# Altium project 7798-20-0228.PrjPcb (part 2 of 2)
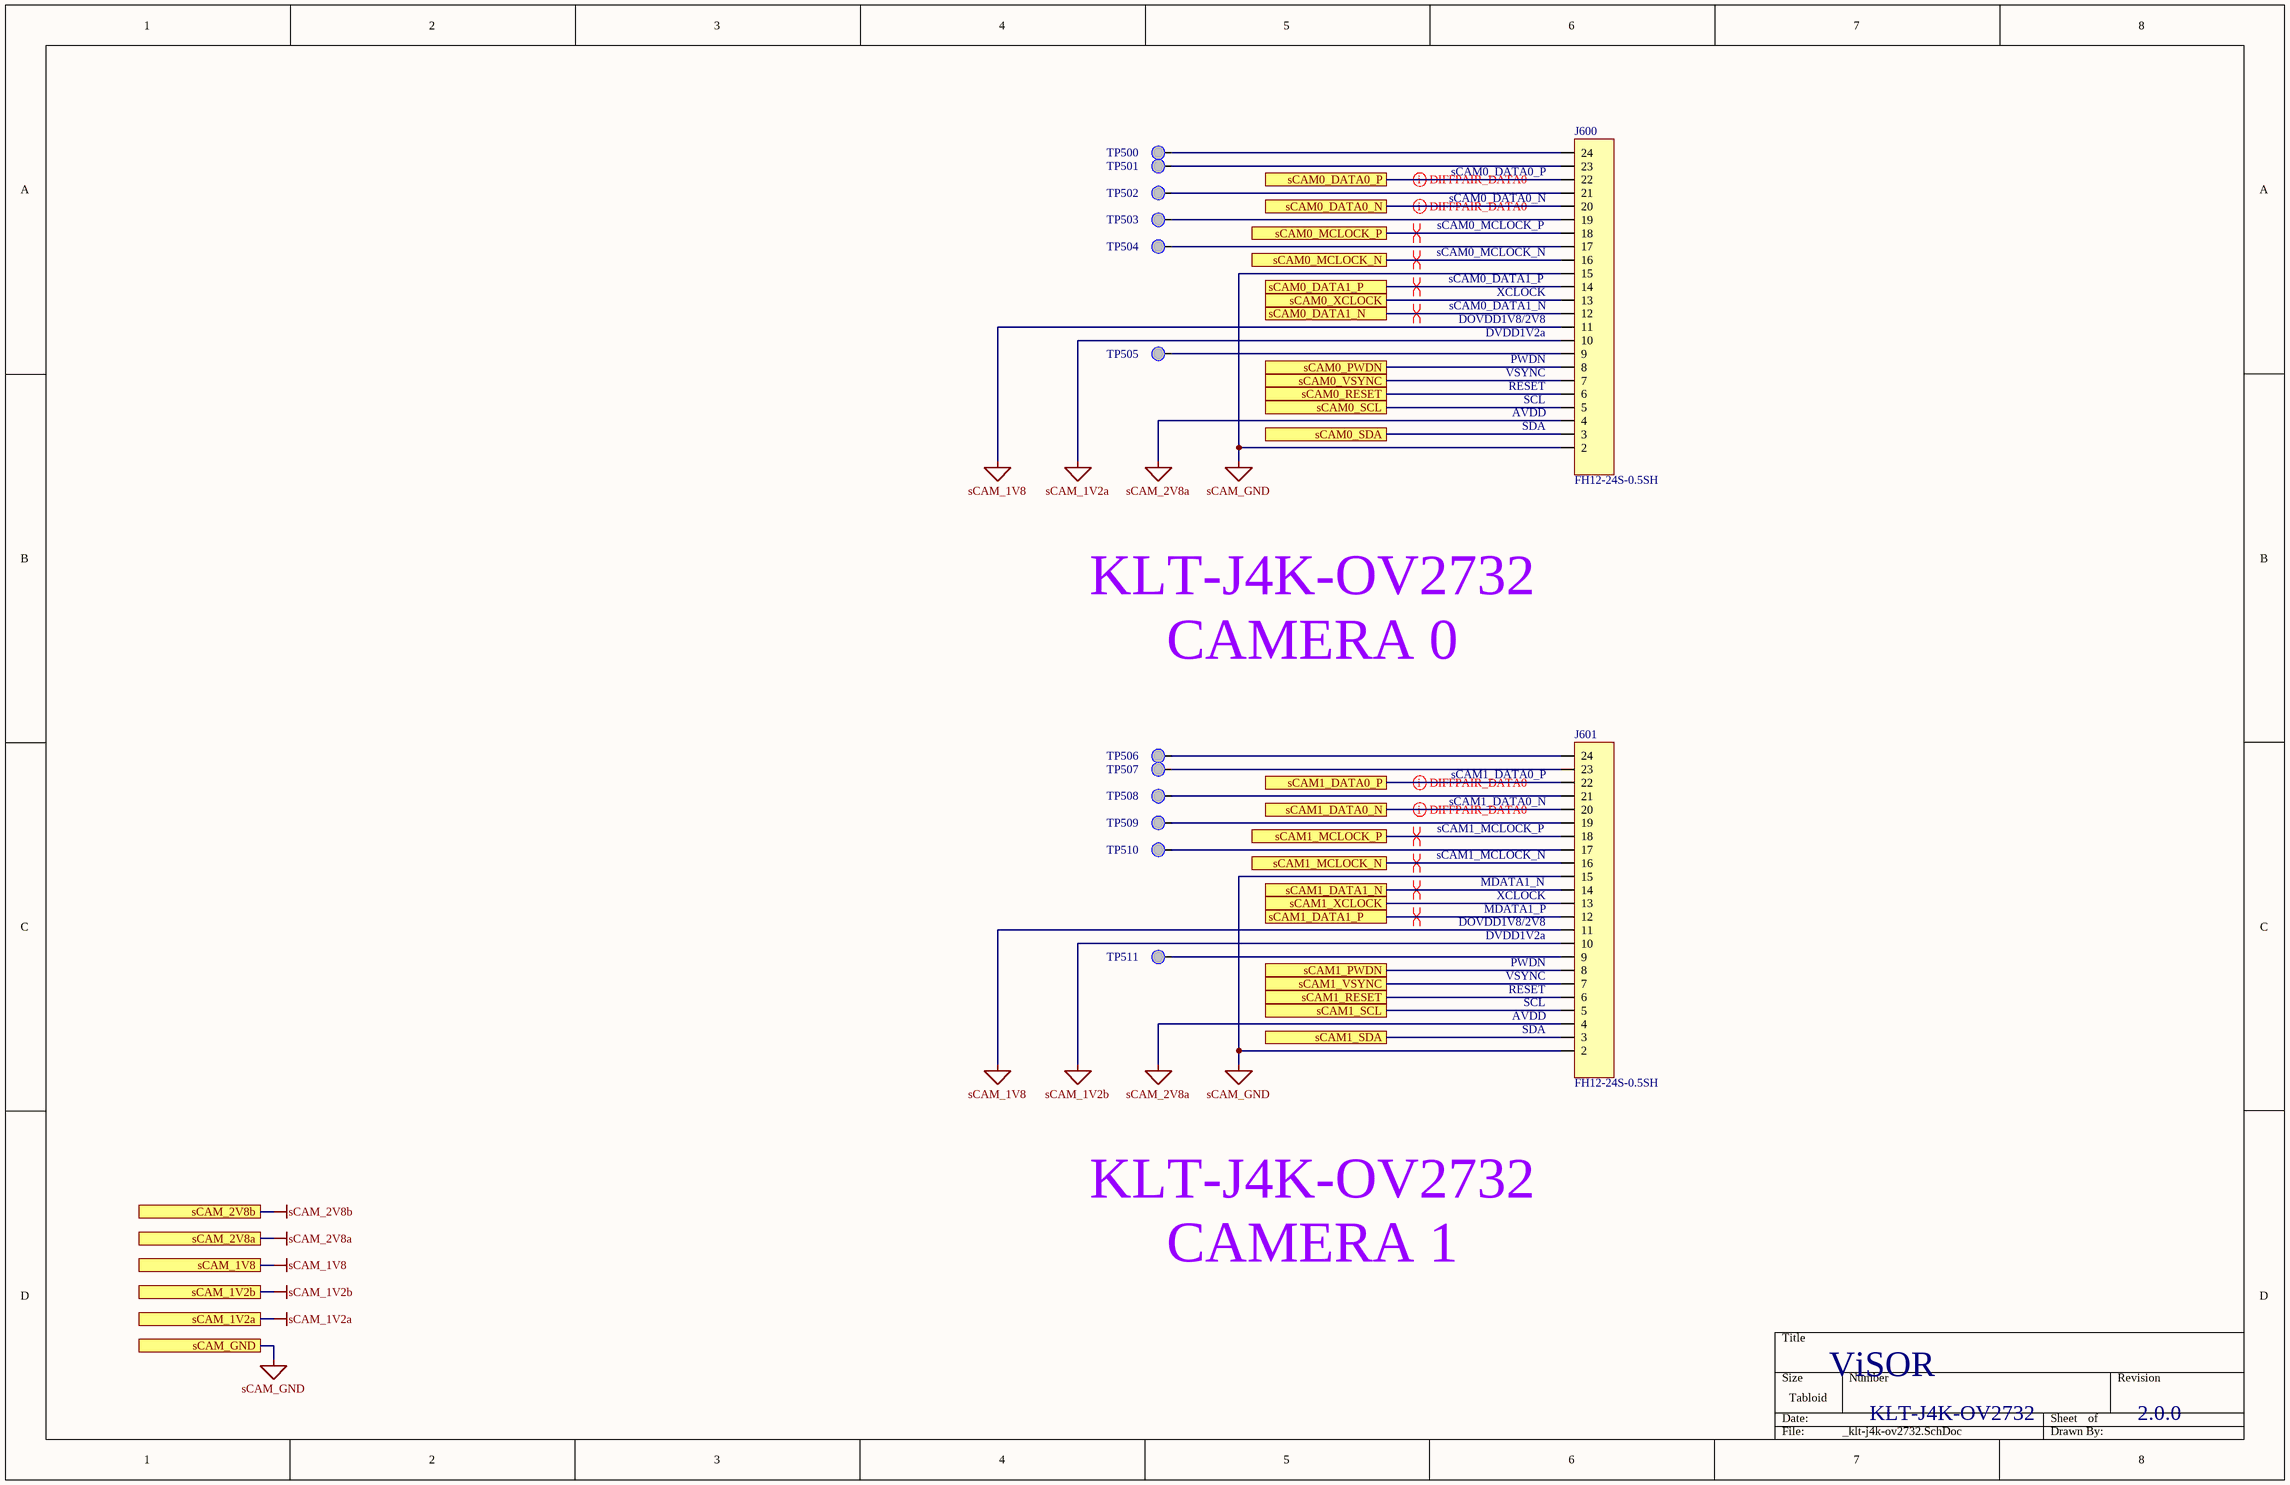
[diagram p9: _klt-j4k-ov2732.SchDoc]

## Nets that join several sheets
sGND: _dragonboard (31 pins), _power (33 pins), _io (17 pins), _accel_mag (11 pins), _gyroscope (19 pins), _li-ov5640-mipi-af (22 pins), _klt-kr7-ov7251 (24 pins), _klt-j4k-ov2732 (J600.2 J600.15 J601.2 J601.15)
sPWR_1V2a: _power (C109.2 R104.1 TP107.1 U104.1), _klt-j4k-ov2732 (J600.10)
sPWR_1V2b: _power (C111.2 R105.1 TP108.1 U105.1), _klt-j4k-ov2732 (J601.10)
sPWR_1V5a: _power (C101.2 R100.1 TP100.1 U100.1), _li-ov5640-mipi-af (C405.2 C407.1 U400.10), _klt-kr7-ov7251 (C505.2 C507.1 J500.14)
sPWR_1V5b: _power (C103.2 R101.1 TP102.1 U101.1), _li-ov5640-mipi-af (C413.2 C415.1 U401.10), _klt-kr7-ov7251 (C513.2 C515.1 J501.14)
sPWR_1V8: _dragonboard (C4.2 C6.2 J2.35 TP15.1), _io (J5.2 R11.2), _accel_mag (5 pins), _gyroscope (C351.2 R350.1 U350.18), _li-ov5640-mipi-af (6 pins), _klt-kr7-ov7251 (6 pins), _klt-j4k-ov2732 (J600.11 J601.11)
sPWR_2V8a: _power (C105.2 R102.1 TP103.1 U102.1), _li-ov5640-mipi-af (6 pins), _klt-kr7-ov7251 (6 pins), _klt-j4k-ov2732 (J600.4 J601.4)
sPWR_2V8b: _power (C107.2 R103.1 TP104.1 U103.1), _li-ov5640-mipi-af (6 pins)
sPWR_3V3: _power (5 pins), _io (5 pins), _accel_mag (C303.2 C304.2 U300.14), _gyroscope (C352.2 C353.1 U350.15 U350.17)
sPWR_5V0: _dragonboard (C3.2 C5.2 J2.37 TP14.1), _power (23 pins)
sSYS_DCIN: _dragonboard (J2.36 J2.38), _power (J3.1)
sCAM0_DATA0_N: _dragonboard (J1.10), _li-ov5640-mipi-af (U400.22), _klt-kr7-ov7251 (J500.10), _klt-j4k-ov2732 (J600.20)
sCAM0_DATA0_P: _dragonboard (J1.8), _li-ov5640-mipi-af (U400.20), _klt-kr7-ov7251 (J500.11), _klt-j4k-ov2732 (J600.22)
sCAM0_DATA1_N: _dragonboard (J1.16), _li-ov5640-mipi-af (U400.14), _klt-j4k-ov2732 (J600.12)
sCAM0_DATA1_P: _dragonboard (J1.14), _li-ov5640-mipi-af (U400.12), _klt-j4k-ov2732 (J600.14)
sCAM0_SCL: TOP (R12.2 TP11.1), _li-ov5640-mipi-af (U400.5), _klt-kr7-ov7251 (J500.3), _klt-j4k-ov2732 (J600.5)
sCAM0_SDA: TOP (R14.2 TP12.1), _li-ov5640-mipi-af (U400.3), _klt-kr7-ov7251 (J500.2), _klt-j4k-ov2732 (J600.3)
sCAM1_DATA0_N: _dragonboard (J1.44), _li-ov5640-mipi-af (U401.22), _klt-kr7-ov7251 (J501.10), _klt-j4k-ov2732 (J601.20)
sCAM1_DATA0_P: _dragonboard (J1.42), _li-ov5640-mipi-af (U401.20), _klt-kr7-ov7251 (J501.11), _klt-j4k-ov2732 (J601.22)
sCAM1_DATA1_N: _dragonboard (J1.50), _li-ov5640-mipi-af (U401.14), _klt-j4k-ov2732 (J601.14)
sCAM1_DATA1_P: _dragonboard (J1.48), _li-ov5640-mipi-af (U401.12), _klt-j4k-ov2732 (J601.12)
sCAM1_MCLOCK_N: _dragonboard (J1.56), _li-ov5640-mipi-af (U401.18), _klt-kr7-ov7251 (J501.7), _klt-j4k-ov2732 (J601.16)
sCAM1_MCLOCK_P: _dragonboard (J1.54), _li-ov5640-mipi-af (U401.16), _klt-kr7-ov7251 (J501.8), _klt-j4k-ov2732 (J601.18)
sCAM1_SCL: TOP (R13.2 R15.2 TP10.1), _li-ov5640-mipi-af (U401.5), _klt-kr7-ov7251 (J501.3), _klt-j4k-ov2732 (J601.5)
sCAM1_SDA: TOP (R16.2 R17.2 TP13.1), _li-ov5640-mipi-af (U401.3), _klt-kr7-ov7251 (J501.2), _klt-j4k-ov2732 (J601.3)
sCSI0_MCLOCK_N: _dragonboard (J1.4), _li-ov5640-mipi-af (U400.18), _klt-kr7-ov7251 (J500.7), _klt-j4k-ov2732 (J600.16)
sCSI0_MCLOCK_P: _dragonboard (J1.2), _li-ov5640-mipi-af (U400.16), _klt-kr7-ov7251 (J500.8), _klt-j4k-ov2732 (J600.18)
sCSI0_XCLOCK/sCAM0_XCLOCK: _dragonboard (J1.15), _li-ov5640-mipi-af (U400.13), _klt-kr7-ov7251 (J500.5), _klt-j4k-ov2732 (J600.13)
sCSI1_XCLOCK/sCAM1_XCLOCK: _dragonboard (J1.17), _li-ov5640-mipi-af (U401.13), _klt-kr7-ov7251 (J501.5), _klt-j4k-ov2732 (J601.13)
sGPIO_0/sIND2: _dragonboard (J2.5), _io (U3.1)
sGPIO_1/sSW2: _dragonboard (J2.7), _io (D1.1 SW2.3 SW2.4)
sGPIO_2/sIND1: _dragonboard (J2.3), _io (U2.1)
sGPIO_3/sSW4: _dragonboard (J2.9), _io (D2.1 SW4.3 SW4.4)
sGPIO_12/sSW1: _dragonboard (J2.24), _io (D1.2 SW1.3 SW1.4)
sGPIO_13/sCAM0_STROBE: _dragonboard (J2.25), _li-ov5640-mipi-af (U400.1), _klt-kr7-ov7251 (J500.18)
sGPIO_16/sGYRO_INT2: _dragonboard (J2.16), _gyroscope (U350.2)
sGPIO_17/sAG_INT2: _dragonboard (J2.10), _accel_mag (R300.2 U300.9)
sGPIO_18/sGYRO_INT1: _dragonboard (J2.12), _gyroscope (U350.3)
sGPIO_19/sAG_INT1: _dragonboard (J2.8), _accel_mag (R301.2 U300.11)
sGPIO_24/sIND4: _dragonboard (J2.29), _io (U5.1)
sGPIO_28/sCAM1_RESET: _dragonboard (J2.33), _li-ov5640-mipi-af (U401.6), _klt-kr7-ov7251 (J501.1), _klt-j4k-ov2732 (J601.6)
sGPIO_33/sCAM1_PWDN: _dragonboard (J2.34), _li-ov5640-mipi-af (U401.8), _klt-j4k-ov2732 (J601.8)
sGPIO_34/sCAM0_PWDN: _dragonboard (J2.32), _li-ov5640-mipi-af (U400.8), _klt-j4k-ov2732 (J600.8)
sGPIO_35/sCAM0_RESET: _dragonboard (J2.31), _li-ov5640-mipi-af (U400.6), _klt-kr7-ov7251 (J500.1), _klt-j4k-ov2732 (J600.6)
sGPIO_36/sLDO_~{SHDN}: _dragonboard (J2.23), _power (R2.2)
sGPIO_69/sCAM1_STROBE: _dragonboard (J2.26), _li-ov5640-mipi-af (U401.1), _klt-kr7-ov7251 (J501.18)
sGPIO_110/sCAM1_VSYNC: _dragonboard (J2.14), _klt-kr7-ov7251 (J501.24), _klt-j4k-ov2732 (J601.7)
sGPIO_114/sCAM0_VSYNC: _dragonboard (J2.20), _klt-kr7-ov7251 (J500.24), _klt-j4k-ov2732 (J600.7)
sGPIO_115/sIND3: _dragonboard (J2.27), _io (U4.1)
sI2C0_SCL: _dragonboard (J2.15), _accel_mag (U300.4), _gyroscope (U350.11)
sI2C0_SDA: _dragonboard (J2.17), _accel_mag (U300.6), _gyroscope (U350.12)
sI2C1_SCL: TOP (R13.1), _dragonboard (J2.19)
sI2C1_SDA: TOP (R16.1), _dragonboard (J2.21)
sI2C2_SCL: TOP (R12.1), _dragonboard (J1.32)
sI2C2_SDA: TOP (R14.1), _dragonboard (J1.34)
sI2C3_SCL: TOP (R15.1), _dragonboard (J1.36)
sI2C3_SDA: TOP (R17.1), _dragonboard (J1.38)
sMPP_4/sSW3: _dragonboard (J2.28), _io (D2.2 SW3.3 SW3.4)
sUART1_RX/sEXTERNAL_TX: _dragonboard (J2.13), _io (R10.2)
sUART1_TX/sEXTERNAL_RX: _dragonboard (J2.11), _io (R8.2)